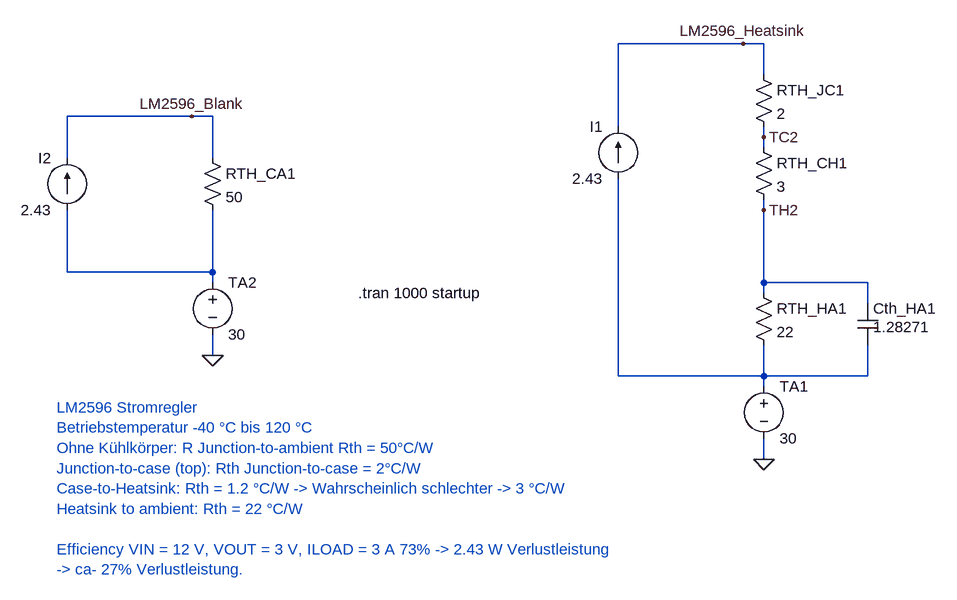
[diagram p0: schematic Thermische_Simulation.asc]
Thermische_Simulation.asc, the LTspice schematic file:
Version 4.1
SHEET 1 1416 768
WIRE 640 -32 448 -32
WIRE 672 -32 640 -32
WIRE 672 16 672 -32
WIRE -208 80 -400 80
WIRE -176 80 -208 80
WIRE 448 96 448 -32
WIRE 672 112 672 96
WIRE 672 128 672 112
WIRE -400 144 -400 80
WIRE -176 144 -176 80
WIRE 672 224 672 208
WIRE -400 320 -400 224
WIRE -176 320 -176 224
WIRE -176 320 -400 320
WIRE -176 336 -176 320
WIRE 672 336 672 224
WIRE 832 336 672 336
WIRE 672 352 672 336
WIRE 832 368 832 336
WIRE -176 448 -176 416
WIRE 448 480 448 176
WIRE 672 480 672 432
WIRE 672 480 448 480
WIRE 832 480 832 432
WIRE 832 480 672 480
WIRE 672 496 672 480
WIRE 672 608 672 576
FLAG 672 608 0
FLAG 640 -32 LM2596_Heatsink
FLAG 672 112 TC2
FLAG 672 224 TH2
FLAG -176 448 0
FLAG -208 80 LM2596_Blank
SYMBOL voltage 672 480 R0
SYMATTR InstName TA1
SYMATTR Value 30
SYMBOL res 656 112 R0
SYMATTR InstName RTH_CH1
SYMATTR Value 3
SYMBOL res 656 0 R0
SYMATTR InstName RTH_JC1
SYMATTR Value 2
SYMBOL res 656 336 R0
SYMATTR InstName RTH_HA1
SYMATTR Value 22
SYMBOL cap 816 368 R0
WINDOW 3 24 36 Left 2
SYMATTR Value 1.28271
SYMATTR InstName Cth_HA1
SYMBOL voltage -176 320 R0
WINDOW 123 0 0 Left 0
WINDOW 39 0 0 Left 0
SYMATTR InstName TA2
SYMATTR Value 30
SYMBOL res -192 128 R0
SYMATTR InstName RTH_CA1
SYMATTR Value 50
SYMBOL current 448 176 R180
WINDOW 0 24 80 Left 2
WINDOW 3 24 0 Left 2
WINDOW 123 0 0 Left 0
WINDOW 39 0 0 Left 0
SYMATTR InstName I1
SYMATTR Value 2.43
SYMBOL current -400 224 R180
WINDOW 0 24 80 Left 2
WINDOW 3 24 0 Left 2
WINDOW 123 0 0 Left 0
WINDOW 39 0 0 Left 0
SYMATTR InstName I2
SYMATTR Value 2.43
TEXT -416 528 Left 2 ;LM2596 Stromregler\nBetriebstemperatur -40 °C bis 120 °C\nOhne Kühlkörper: R Junction-to-ambient Rth = 50°C/W\nJunction-to-case (top): Rth Junction-to-case = 2°C/W\nCase-to-Heatsink: Rth = 1.2 °C/W -> Wahrscheinlich schlechter -> 3 °C/W\nHeatsink to ambient: Rth = 22 °C/W\n \nEfficiency VIN = 12 V, VOUT = 3 V, ILOAD = 3 A 73% -> 2.43 W Verlustleistung\n-> ca- 27% Verlustleistung.
TEXT 48 352 Left 2 !.tran 1000 startup

The netlist it stands for:
* Thermische_Simulation.asc
V§TA1 N002 0 30
RTH_CH1 TC2 TH2 3
RTH_JC1 LM2596_Heatsink TC2 2
RTH_HA1 TH2 N002 22
Cth_HA1 TH2 N002 1.28271
V§TA2 N001 0 30
RTH_CA1 LM2596_Blank N001 50
I1 N002 LM2596_Heatsink 2.43
I2 N001 LM2596_Blank 2.43
* LM2596 Stromregler
* Betriebstemperatur -40 °C bis 120 °C
* Ohne Kühlkörper: R Junction-to-ambient Rth = 50°C/W
* Junction-to-case (top): Rth Junction-to-case = 2°C/W
* Case-to-Heatsink: Rth = 1.2 °C/W -> Wahrscheinlich schlechter -> 3 °C/W
* Heatsink to ambient: Rth = 22 °C/W
* Efficiency VIN = 12 V, VOUT = 3 V, ILOAD = 3 A 73% -> 2.43 W Verlustleistung
* -> ca- 27% Verlustleistung.
.tran 1000 startup
.backanno
.end